# Altium project USB-3.0-Hub.PrjPcb
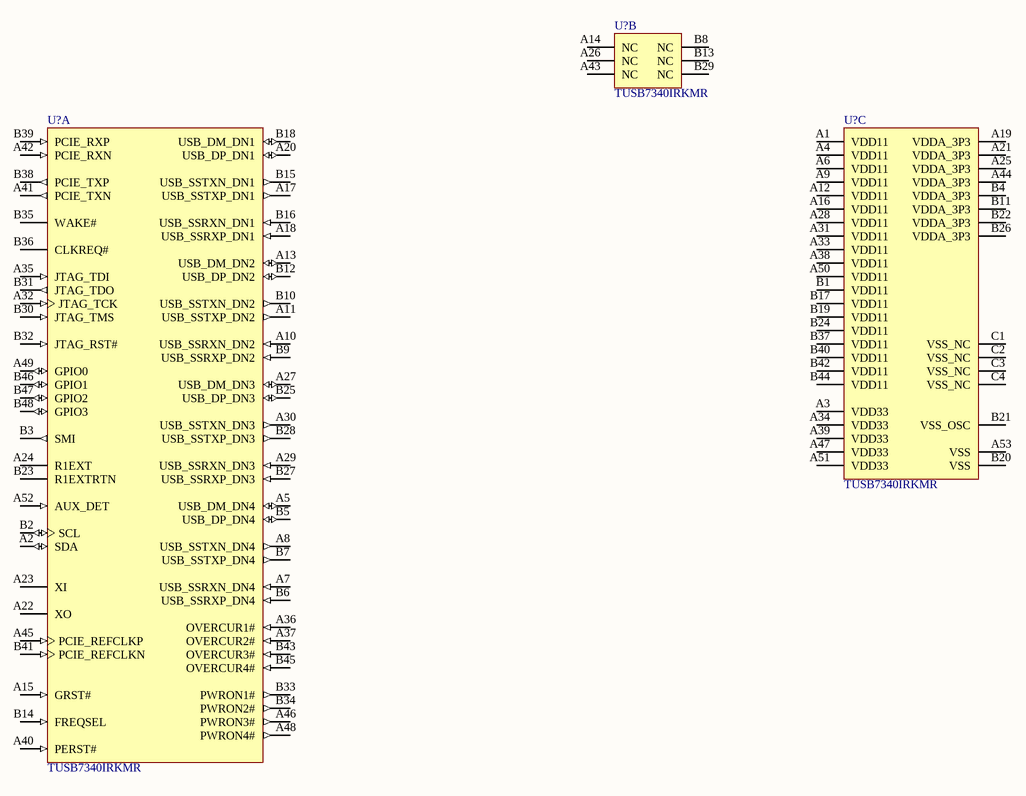
[diagram p0: Sheet1.SchDoc]
1 sheet, 3 parts. Net scope: global (net labels, ports and power ports of the same name join across sheets).
Board file: PCB1.PcbDoc

## Sheet Sheet1.SchDoc
size A4; SheetNumber: 1; SheetTotal: 1

### Parts
(Parts that share a designator on the sheet are numbered #1, #2 ... from top to bottom, then left to right.)
U?#1  TUSB7340IRKMR  [RKM0100A_V]  (part B of 3)
U?#2  TUSB7340IRKMR  [RKM0100A_V]  (part A of 3)
U?#3  TUSB7340IRKMR  [RKM0100A_V]  (part C of 3)

### Nets

Not connected (* = marked no-connect by the designer): U?#1 A14(NC) A26(NC) A43(NC) B8(NC) B13(NC) B29(NC); U?#2 A2(SDA) A5(USB_DM_DN4) A7(USB_SSRXN_DN4) A8(USB_SSTXN_DN4) A10(USB_SSRXN_DN2) A11(USB_SSTXP_DN2) A13(USB_DM_DN2) A15(GRST#) A17(USB_SSTXP_DN1) A18(USB_SSRXP_DN1) A20(USB_DP_DN1) A22(XO) A23(XI) A24(R1EXT) A27(USB_DM_DN3) A29(USB_SSRXN_DN3) A30(USB_SSTXN_DN3) A32(JTAG_TCK) A35(JTAG_TDI) A36(OVERCUR1#) A37(OVERCUR2#) A40(PERST#) A41(PCIE_TXN) A42(PCIE_RXN) A45(PCIE_REFCLKP) A46(PWRON3#) A48(PWRON4#) A49(GPIO0) A52(AUX_DET) B2(SCL) B3(SMI) B5(USB_DP_DN4) B6(USB_SSRXP_DN4) B7(USB_SSTXP_DN4) B9(USB_SSRXP_DN2) B10(USB_SSTXN_DN2) B12(USB_DP_DN2) B14(FREQSEL) B15(USB_SSTXN_DN1) B16(USB_SSRXN_DN1) B18(USB_DM_DN1) B23(R1EXTRTN) B25(USB_DP_DN3) B27(USB_SSRXP_DN3) B28(USB_SSTXP_DN3) B30(JTAG_TMS) B31(JTAG_TDO) B32(JTAG_RST#) B33(PWRON1#) B34(PWRON2#) B35(WAKE#) B36(CLKREQ#) B38(PCIE_TXP) B39(PCIE_RXP) B41(PCIE_REFCLKN) B43(OVERCUR3#) B45(OVERCUR4#) B46(GPIO1) B47(GPIO2) B48(GPIO3); U?#3 A1(VDD11) A3(VDD33) A4(VDD11) A6(VDD11) A9(VDD11) A12(VDD11) A16(VDD11) A19(VDDA_3P3) A21(VDDA_3P3) A25(VDDA_3P3) A28(VDD11) A31(VDD11) A33(VDD11) A34(VDD33) A38(VDD11) A39(VDD33) A44(VDDA_3P3) A47(VDD33) A50(VDD11) A51(VDD33) A53(VSS) B1(VDD11) B4(VDDA_3P3) B11(VDDA_3P3) B17(VDD11) B19(VDD11) B20(VSS) B21(VSS_OSC) B22(VDDA_3P3) B24(VDD11) B26(VDDA_3P3) B37(VDD11) B40(VDD11) B42(VDD11) B44(VDD11) C1(VSS_NC) C2(VSS_NC) C3(VSS_NC) C4(VSS_NC)

### Library data of the parts
U?#1-U?#3 = CMP-0309-00053-2: SuperSpeed USB 4-Port xHCI Host Controller, 1.1 / 3.3V, -40 to 85 degC, 100-Pin WQFN (RKM), Green (RoHS & no Sb/Br); Manufacturer: Texas Instruments; App Proc Local Bus: x1 PCIe Gen2; SubFamily: USB Host and On-the-Go; Max# Host Ports: 4; Supply Voltage(s)(V): 3.3, 1.1; PackageVersion: revC, Oct-2011; PackageReference: RKM0100A; PartNumber: TUSB7340IRKMR; DatasheetVersion: SLLSE76H; USB Speed: SuperSpeed; ComponentLink1Description: Datasheet; ComponentLink2URL: http://www.ti.com/litv/pdf/mpqf258b; PackageDescription: 100-Pin Plastic Quad Flatpack No-Lead 0.6 mm Pitch; Mounting Technology: Surface Mount; Eco-Plan: Green (RoHS & no Sb/Br); ComponentLink1URL: http://www.ti.com/general/docs/lit/getliterature.tsp?genericPartNumber=TUSB7340&fileType=pdf; ComponentLink2Description: Package Specification